# Altium schematic sheet STeaMi-VerA.SchDoc
size A3; DocumentNumber: 1; SheetNumber: 1; SheetTotal: 16
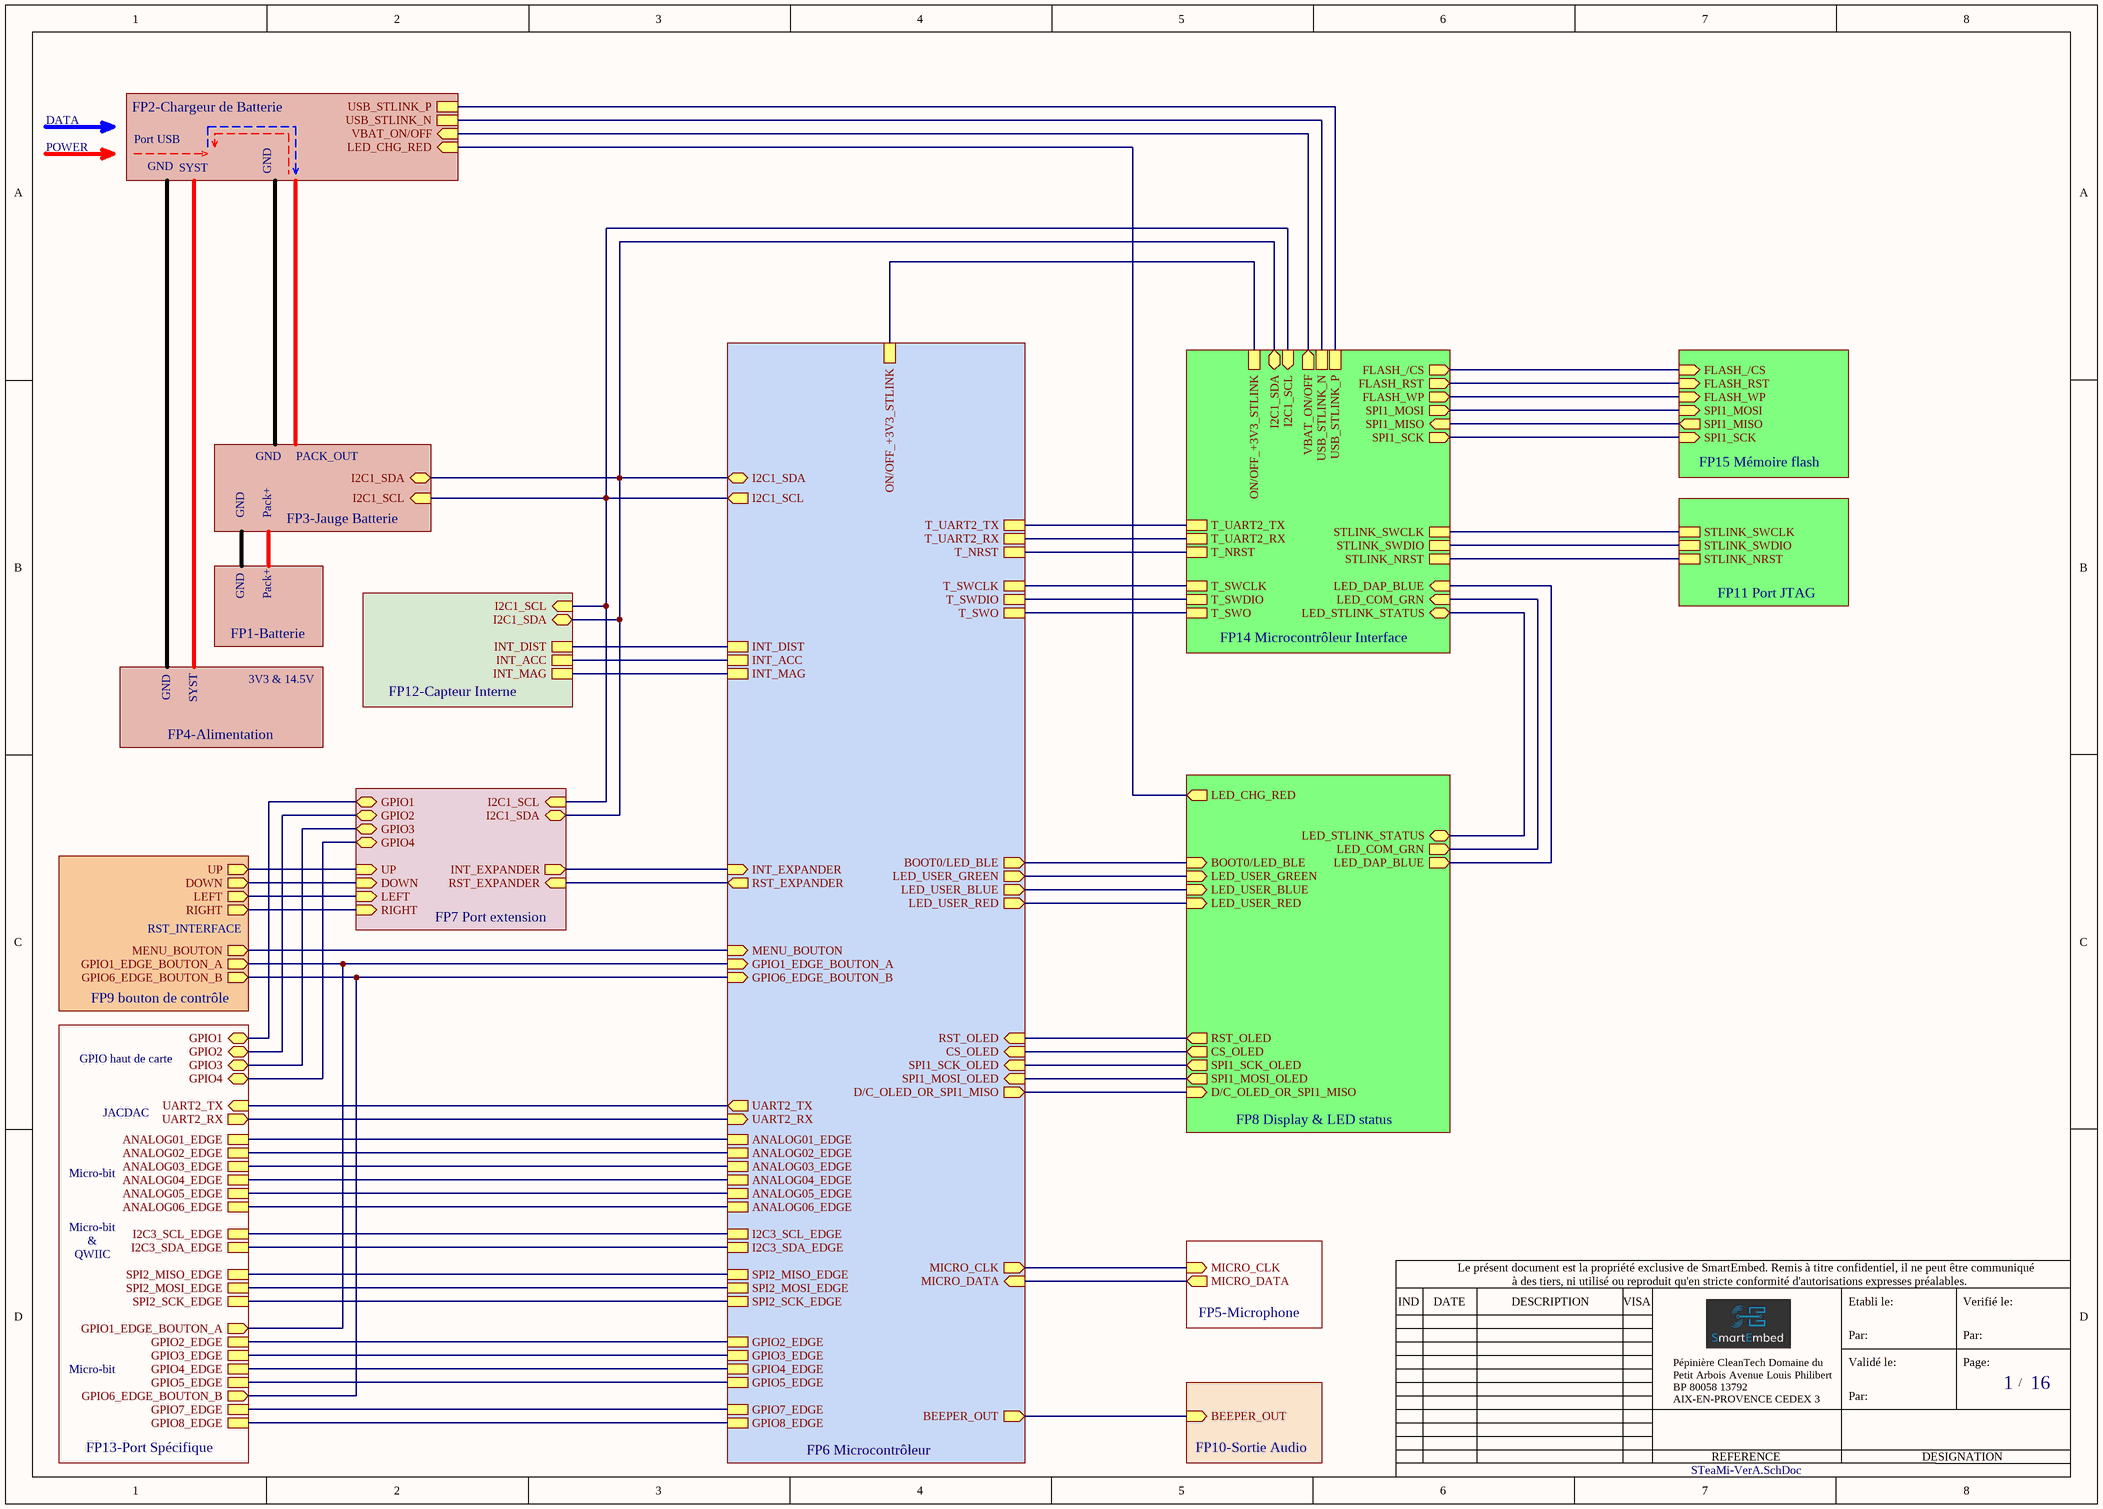
[diagram p0: STeaMi-VerA.SchDoc]

## Sub-sheets
FP1-Batterie = STE01-FP1-Batterie.SchDoc: no entries
FP2-Chargeur de Batterie = STE01-FP2-Chargeur de batterie.SchDoc: LED_CHG_RED (in), USB_STLINK_N, USB_STLINK_P, VBAT_ON/OFF (in)
FP3-Jauge Batterie = STE01-FP3-Jauge Batterie.SchDoc: I2C1_SDA (bidir), I2C1_SCL (in)
FP4-Alimentation = STE01-FP4-Alimentation.SchDoc: no entries
FP5-Microphone = STE01-FP5-Microphone.SchDoc: MICRO_CLK (in), MICRO_DATA (out)
FP6 Microcontrôleur = STE01-FP6-Microcontrôleur.SchDoc: I2C1_SDA (bidir), I2C1_SCL (out), INT_EXPANDER (in), RST_EXPANDER (out), MENU_BOUTON (in), GPIO1_EDGE_BOUTON_A (in), GPIO6_EDGE_BOUTON_B (in), GPIO8_EDGE, GPIO7_EDGE, GPIO5_EDGE, GPIO4_EDGE, GPIO3_EDGE, GPIO2_EDGE, SPI2_SCK_EDGE, SPI2_MOSI_EDGE, I2C3_SCL_EDGE, I2C3_SDA_EDGE, SPI2_MISO_EDGE, ANALOG06_EDGE, ANALOG05_EDGE, ANALOG04_EDGE, ANALOG03_EDGE, ANALOG02_EDGE, ANALOG01_EDGE, INT_DIST, INT_ACC, INT_MAG, UART2_RX (in), UART2_TX (out), MICRO_CLK (out), MICRO_DATA (in), BEEPER_OUT (out), SPI1_MOSI_OLED (in), SPI1_SCK_OLED (in), CS_OLED (in), RST_OLED (in), LED_USER_RED (out), LED_USER_BLUE (out), LED_USER_GREEN (out), BOOT0/LED_BLE (out), ON/OFF_+3V3_STLINK, T_UART2_TX, T_UART2_RX, T_NRST, T_SWCLK, T_SWDIO, T_SWO, D/C_OLED_OR_SPI1_MISO (out)
FP7 Port extension = STE01-FP7-Port extention.SchDoc: RST_EXPANDER (in), INT_EXPANDER (out), I2C1_SCL (in), I2C1_SDA (bidir), RIGHT (in), LEFT (in), DOWN (in), UP (in), GPIO4 (bidir), GPIO3 (bidir), GPIO2 (bidir), GPIO1 (bidir)
FP8 Display & LED status = STE01-FP8-Display & LED statuts.SchDoc: RST_OLED (out), CS_OLED (out), SPI1_SCK_OLED (out), LED_USER_BLUE (in), LED_USER_RED (in), SPI1_MOSI_OLED (out), LED_CHG_RED (out), LED_COM_GRN (out), LED_STLINK_STATUS (bidir), LED_DAP_BLUE (out), LED_USER_GREEN (in), BOOT0/LED_BLE (in), D/C_OLED_OR_SPI1_MISO (in)
FP9 bouton de contrôle = STE01-FP9-Bouton de contrôle.SchDoc: MENU_BOUTON (out), GPIO1_EDGE_BOUTON_A (out), GPIO6_EDGE_BOUTON_B (out), UP (out), DOWN (out), LEFT (out), RIGHT (out)
FP10-Sortie Audio = STE01-FP10-Sortie Audio.SchDoc: BEEPER_OUT (in)
FP11 Port JTAG = STE01-FP11-Port JTAG.SchDoc: STLINK_SWCLK, STLINK_SWDIO, STLINK_NRST
FP12-Capteur Interne = STE01-FP12-Capteur interne.SchDoc: INT_MAG, INT_ACC, INT_DIST, I2C1_SDA (bidir), I2C1_SCL (in)
FP13-Port Spécifique = STE01-FP13-Port Spécifique.SchDoc: ANALOG01_EDGE, ANALOG02_EDGE, ANALOG03_EDGE, ANALOG04_EDGE, ANALOG05_EDGE, ANALOG06_EDGE, I2C3_SCL_EDGE, I2C3_SDA_EDGE, SPI2_MISO_EDGE, SPI2_MOSI_EDGE, GPIO1 (bidir), GPIO2 (bidir), GPIO3 (bidir), GPIO4 (bidir), GPIO1_EDGE_BOUTON_A (out), GPIO6_EDGE_BOUTON_B (out), SPI2_SCK_EDGE, GPIO7_EDGE, GPIO2_EDGE, GPIO3_EDGE, GPIO4_EDGE, GPIO5_EDGE, GPIO8_EDGE, UART2_RX (out), UART2_TX (in)
FP14 Microcontrôleur Interface = STE01-FP14-Microcontroleur interface.SchDoc: T_UART2_RX, T_UART2_TX, ON/OFF_+3V3_STLINK, I2C1_SDA (bidir), I2C1_SCL (in), FLASH_RST (out), FLASH_WP (out), SPI1_MOSI (out), SPI1_MISO (in), SPI1_SCK (out), T_SWCLK, T_SWDIO, T_SWO, USB_STLINK_N, USB_STLINK_P, STLINK_SWCLK, STLINK_SWDIO, STLINK_NRST, LED_DAP_BLUE (in), LED_STLINK_STATUS (bidir), LED_COM_GRN (in), FLASH_/CS (out), T_NRST, VBAT_ON/OFF (out)
FP15 Mémoire flash = STE01-FP15-Mémoire flash.SchDoc: FLASH_RST (in), FLASH_WP (in), SPI1_MOSI (in), SPI1_MISO (out), SPI1_SCK (in), FLASH_/CS (in)

## Nets
(unnamed): sheet FP2-Chargeur de Batterie/LED_CHG_RED, sheet FP8 Display & LED status/LED_CHG_RED
(unnamed): sheet FP2-Chargeur de Batterie/USB_STLINK_N, sheet FP14 Microcontrôleur Interface/USB_STLINK_N
(unnamed): sheet FP2-Chargeur de Batterie/USB_STLINK_P, sheet FP14 Microcontrôleur Interface/USB_STLINK_P
(unnamed): sheet FP2-Chargeur de Batterie/VBAT_ON/OFF, sheet FP14 Microcontrôleur Interface/VBAT_ON/OFF
(unnamed): sheet FP3-Jauge Batterie/I2C1_SDA, sheet FP6 Microcontrôleur/I2C1_SDA, sheet FP7 Port extension/I2C1_SDA, sheet FP12-Capteur Interne/I2C1_SDA, sheet FP14 Microcontrôleur Interface/I2C1_SDA
(unnamed): sheet FP3-Jauge Batterie/I2C1_SCL, sheet FP6 Microcontrôleur/I2C1_SCL, sheet FP7 Port extension/I2C1_SCL, sheet FP12-Capteur Interne/I2C1_SCL, sheet FP14 Microcontrôleur Interface/I2C1_SCL
(unnamed): sheet FP5-Microphone/MICRO_CLK, sheet FP6 Microcontrôleur/MICRO_CLK
(unnamed): sheet FP5-Microphone/MICRO_DATA, sheet FP6 Microcontrôleur/MICRO_DATA
(unnamed): sheet FP6 Microcontrôleur/INT_EXPANDER, sheet FP7 Port extension/INT_EXPANDER
(unnamed): sheet FP6 Microcontrôleur/RST_EXPANDER, sheet FP7 Port extension/RST_EXPANDER
(unnamed): sheet FP6 Microcontrôleur/MENU_BOUTON, sheet FP9 bouton de contrôle/MENU_BOUTON
(unnamed): sheet FP6 Microcontrôleur/GPIO1_EDGE_BOUTON_A, sheet FP9 bouton de contrôle/GPIO1_EDGE_BOUTON_A, sheet FP13-Port Spécifique/GPIO1_EDGE_BOUTON_A
(unnamed): sheet FP6 Microcontrôleur/GPIO6_EDGE_BOUTON_B, sheet FP9 bouton de contrôle/GPIO6_EDGE_BOUTON_B, sheet FP13-Port Spécifique/GPIO6_EDGE_BOUTON_B
(unnamed): sheet FP6 Microcontrôleur/GPIO8_EDGE, sheet FP13-Port Spécifique/GPIO8_EDGE
(unnamed): sheet FP6 Microcontrôleur/GPIO7_EDGE, sheet FP13-Port Spécifique/GPIO7_EDGE
(unnamed): sheet FP6 Microcontrôleur/GPIO5_EDGE, sheet FP13-Port Spécifique/GPIO5_EDGE
(unnamed): sheet FP6 Microcontrôleur/GPIO4_EDGE, sheet FP13-Port Spécifique/GPIO4_EDGE
(unnamed): sheet FP6 Microcontrôleur/GPIO3_EDGE, sheet FP13-Port Spécifique/GPIO3_EDGE
(unnamed): sheet FP6 Microcontrôleur/GPIO2_EDGE, sheet FP13-Port Spécifique/GPIO2_EDGE
(unnamed): sheet FP6 Microcontrôleur/SPI2_SCK_EDGE, sheet FP13-Port Spécifique/SPI2_SCK_EDGE
(unnamed): sheet FP6 Microcontrôleur/SPI2_MOSI_EDGE, sheet FP13-Port Spécifique/SPI2_MOSI_EDGE
(unnamed): sheet FP6 Microcontrôleur/I2C3_SCL_EDGE, sheet FP13-Port Spécifique/I2C3_SCL_EDGE
(unnamed): sheet FP6 Microcontrôleur/I2C3_SDA_EDGE, sheet FP13-Port Spécifique/I2C3_SDA_EDGE
(unnamed): sheet FP6 Microcontrôleur/SPI2_MISO_EDGE, sheet FP13-Port Spécifique/SPI2_MISO_EDGE
(unnamed): sheet FP6 Microcontrôleur/ANALOG06_EDGE, sheet FP13-Port Spécifique/ANALOG06_EDGE
(unnamed): sheet FP6 Microcontrôleur/ANALOG05_EDGE, sheet FP13-Port Spécifique/ANALOG05_EDGE
(unnamed): sheet FP6 Microcontrôleur/ANALOG04_EDGE, sheet FP13-Port Spécifique/ANALOG04_EDGE
(unnamed): sheet FP6 Microcontrôleur/ANALOG03_EDGE, sheet FP13-Port Spécifique/ANALOG03_EDGE
(unnamed): sheet FP6 Microcontrôleur/ANALOG02_EDGE, sheet FP13-Port Spécifique/ANALOG02_EDGE
(unnamed): sheet FP6 Microcontrôleur/ANALOG01_EDGE, sheet FP13-Port Spécifique/ANALOG01_EDGE
(unnamed): sheet FP6 Microcontrôleur/INT_DIST, sheet FP12-Capteur Interne/INT_DIST
(unnamed): sheet FP6 Microcontrôleur/INT_ACC, sheet FP12-Capteur Interne/INT_ACC
(unnamed): sheet FP6 Microcontrôleur/INT_MAG, sheet FP12-Capteur Interne/INT_MAG
(unnamed): sheet FP6 Microcontrôleur/UART2_RX, sheet FP13-Port Spécifique/UART2_RX
(unnamed): sheet FP6 Microcontrôleur/UART2_TX, sheet FP13-Port Spécifique/UART2_TX
(unnamed): sheet FP6 Microcontrôleur/BEEPER_OUT, sheet FP10-Sortie Audio/BEEPER_OUT
(unnamed): sheet FP6 Microcontrôleur/SPI1_MOSI_OLED, sheet FP8 Display & LED status/SPI1_MOSI_OLED
(unnamed): sheet FP6 Microcontrôleur/SPI1_SCK_OLED, sheet FP8 Display & LED status/SPI1_SCK_OLED
(unnamed): sheet FP6 Microcontrôleur/CS_OLED, sheet FP8 Display & LED status/CS_OLED
(unnamed): sheet FP6 Microcontrôleur/RST_OLED, sheet FP8 Display & LED status/RST_OLED
(unnamed): sheet FP6 Microcontrôleur/LED_USER_RED, sheet FP8 Display & LED status/LED_USER_RED
(unnamed): sheet FP6 Microcontrôleur/LED_USER_BLUE, sheet FP8 Display & LED status/LED_USER_BLUE
(unnamed): sheet FP6 Microcontrôleur/LED_USER_GREEN, sheet FP8 Display & LED status/LED_USER_GREEN
(unnamed): sheet FP6 Microcontrôleur/BOOT0/LED_BLE, sheet FP8 Display & LED status/BOOT0/LED_BLE
(unnamed): sheet FP6 Microcontrôleur/ON/OFF_+3V3_STLINK, sheet FP14 Microcontrôleur Interface/ON/OFF_+3V3_STLINK
(unnamed): sheet FP6 Microcontrôleur/T_UART2_TX, sheet FP14 Microcontrôleur Interface/T_UART2_TX
(unnamed): sheet FP6 Microcontrôleur/T_UART2_RX, sheet FP14 Microcontrôleur Interface/T_UART2_RX
(unnamed): sheet FP6 Microcontrôleur/T_NRST, sheet FP14 Microcontrôleur Interface/T_NRST
(unnamed): sheet FP6 Microcontrôleur/T_SWCLK, sheet FP14 Microcontrôleur Interface/T_SWCLK
(unnamed): sheet FP6 Microcontrôleur/T_SWDIO, sheet FP14 Microcontrôleur Interface/T_SWDIO
(unnamed): sheet FP6 Microcontrôleur/T_SWO, sheet FP14 Microcontrôleur Interface/T_SWO
(unnamed): sheet FP6 Microcontrôleur/D/C_OLED_OR_SPI1_MISO, sheet FP8 Display & LED status/D/C_OLED_OR_SPI1_MISO
(unnamed): sheet FP7 Port extension/RIGHT, sheet FP9 bouton de contrôle/RIGHT
(unnamed): sheet FP7 Port extension/LEFT, sheet FP9 bouton de contrôle/LEFT
(unnamed): sheet FP7 Port extension/DOWN, sheet FP9 bouton de contrôle/DOWN
(unnamed): sheet FP7 Port extension/UP, sheet FP9 bouton de contrôle/UP
(unnamed): sheet FP7 Port extension/GPIO4, sheet FP13-Port Spécifique/GPIO4
(unnamed): sheet FP7 Port extension/GPIO3, sheet FP13-Port Spécifique/GPIO3
(unnamed): sheet FP7 Port extension/GPIO2, sheet FP13-Port Spécifique/GPIO2
(unnamed): sheet FP7 Port extension/GPIO1, sheet FP13-Port Spécifique/GPIO1
(unnamed): sheet FP8 Display & LED status/LED_COM_GRN, sheet FP14 Microcontrôleur Interface/LED_COM_GRN
(unnamed): sheet FP8 Display & LED status/LED_STLINK_STATUS, sheet FP14 Microcontrôleur Interface/LED_STLINK_STATUS
(unnamed): sheet FP8 Display & LED status/LED_DAP_BLUE, sheet FP14 Microcontrôleur Interface/LED_DAP_BLUE
(unnamed): sheet FP11 Port JTAG/STLINK_SWCLK, sheet FP14 Microcontrôleur Interface/STLINK_SWCLK
(unnamed): sheet FP11 Port JTAG/STLINK_SWDIO, sheet FP14 Microcontrôleur Interface/STLINK_SWDIO
(unnamed): sheet FP11 Port JTAG/STLINK_NRST, sheet FP14 Microcontrôleur Interface/STLINK_NRST
(unnamed): sheet FP14 Microcontrôleur Interface/FLASH_RST, sheet FP15 Mémoire flash/FLASH_RST
(unnamed): sheet FP14 Microcontrôleur Interface/FLASH_WP, sheet FP15 Mémoire flash/FLASH_WP
(unnamed): sheet FP14 Microcontrôleur Interface/SPI1_MOSI, sheet FP15 Mémoire flash/SPI1_MOSI
(unnamed): sheet FP14 Microcontrôleur Interface/SPI1_MISO, sheet FP15 Mémoire flash/SPI1_MISO
(unnamed): sheet FP14 Microcontrôleur Interface/SPI1_SCK, sheet FP15 Mémoire flash/SPI1_SCK
(unnamed): sheet FP14 Microcontrôleur Interface/FLASH_/CS, sheet FP15 Mémoire flash/FLASH_/CS

## Notes on the sheet
- POWER
- DATA
- Port USB
- GND
- SYST
- Pack+
- PACK_OUT
- 3V3 & 14.5V
- RST_INTERFACE
- GPIO haut de carte
- JACDAC
- Micro-bit
- QWIIC
- &
- Le présent document est la propriété exclusive de SmartEmbed. Remis à titre confidentiel, il ne peut être communiqué
- IND
- DATE
- DESCRIPTION
- VISA
- à des tiers, ni utilisé ou reproduit qu'en stricte conformité d'autorisations expresses préalables.
- Etabli le:
- Verifié le:
- Validé le:
- Par:
- Page:
- /
- Pépinière CleanTech Domaine du Petit Arbois Avenue Louis Philibert BP 80058 13792 AIX-EN-PROVENCE CEDEX 3
- REFERENCE
- DESIGNATION